# EAGLE board EasyBMS (EAGLE 9.6.2)
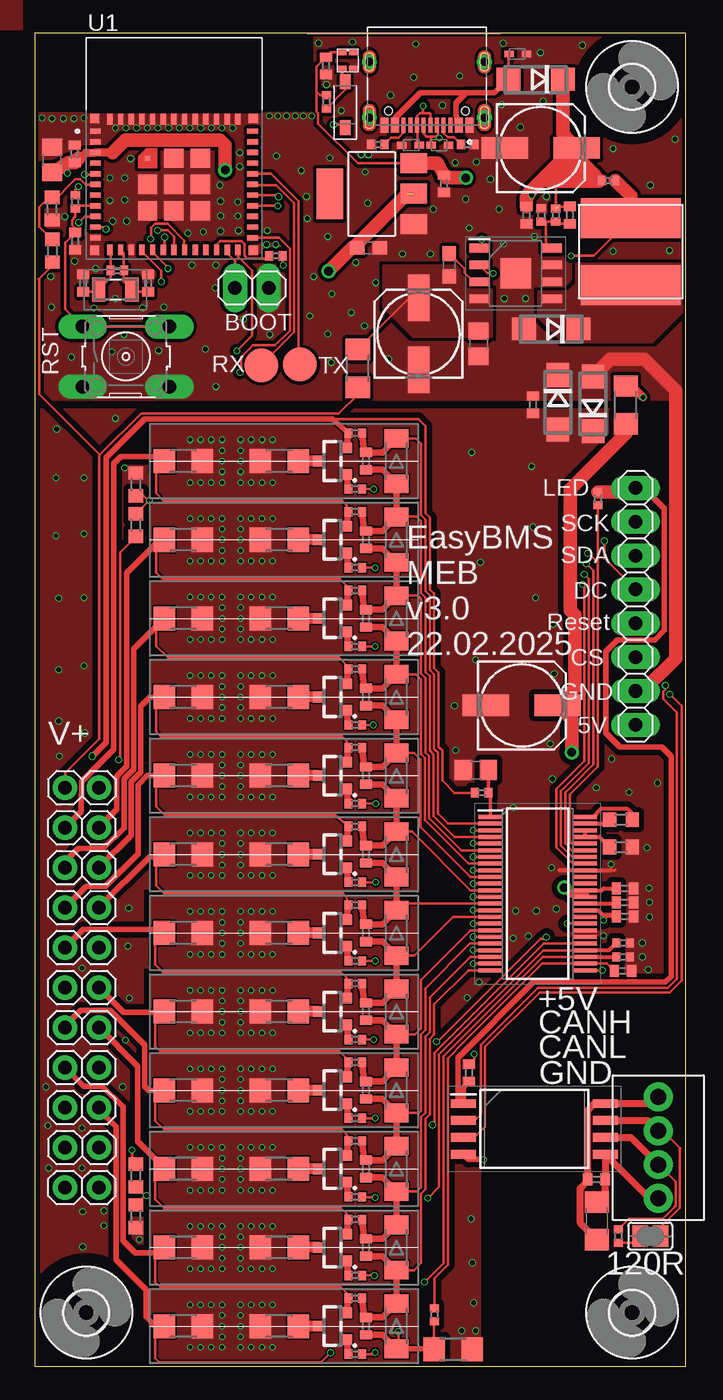
[diagram p3: board, top side]
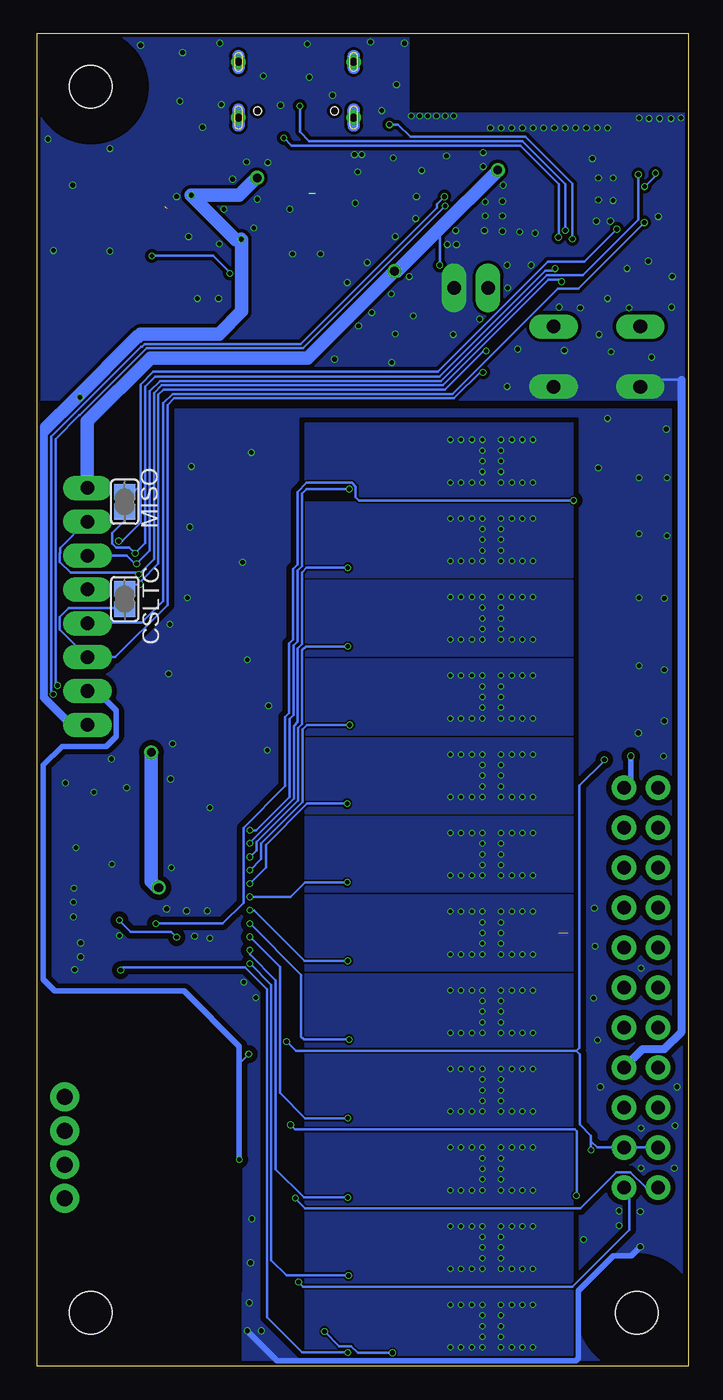
[diagram p4: board, bottom side, seen from below]

Size 48.85 x 100 mm. Coordinates in mm from the lower left corner, seen from the top.
Outline: 0,100 0,0 48.85,0 48.85,100 0,100
Copper layers (1*16): Top 0.035mm / dielectric 1.6mm / Bottom 0.035mm
Design rules "jlcpcb-2layers *": minimum track width 5mil, minimum drill 0.3mm, track to track 5mil, track to pad 5mil, pad to pad 5mil, via to via 5mil, smd to smd 5mil, copper to edge 0.2mm, drill to drill 6mil, minimum pad ring 10mil, minimum via ring 3mil, stop-mask expansion 4mil, vias tented up to drill 50mil, thermal gap 10mil

## Footprints (pad centres in the part's own frame; a part is rotated, then mirrored left to right if it is on the bottom)
1X02 = drill 1.016 long: 1 -1.27,0; 2 1.27,0
C0402 = smd 0.7 x 0.9: 1 -0.65,0; 2 0.65,0
153CLV-0605 = smd 3.5 x 1.6: + 2.7,0; - -2.7,0
C0603 = smd 1.1 x 1: 1 -0.85,0; 2 0.85,0
C1206 = smd 1.6 x 1.8: 1 -1.4,0; 2 1.4,0
C0805 = smd 1.3 x 1.5: 1 -0.95,0; 2 0.95,0
SJ = smd 1.168 x 1.6: 1 -0.762,0; 2 0.762,0
DO214AC = smd 1.8 x 1.7: A 2.05,0; C -2.05,0
MELF-MLL34 = smd 1.4 x 1.8: 1 -1.7,0; 2 1.7,0
SOD523 = smd 0.7 x 0.5: A 0.7,0; C -0.6,0
SOD3715X135 = smd 1.127 x 0.784: 1 -1.722,0; 2 1.722,0
3,2 = hole 3.2: 0,0
SOIC127P600X170-9N = smd 1.525 x 0.65: 1 -2.712,1.905; 2 -2.712,0.635; 3 -2.712,-0.635; 4 -2.712,-1.905; 5 2.712,-1.905; 6 2.712,-0.635; 7 2.712,0.635; 8 2.712,1.905 | smd 2.28 x 2.28: 9 0,0
SOP50P780X200-48N = smd 1.8 x 0.3: 1 -3.55,5.75; 2 -3.55,5.25; 3 -3.55,4.75; 4 -3.55,4.25; 5 -3.55,3.75; 6 -3.55,3.25; 7 -3.55,2.75; 8 -3.55,2.25; 9 -3.55,1.75; 10 -3.55,1.25; 11 -3.55,0.75; 12 -3.55,0.25; 13 -3.55,-0.25; 14 -3.55,-0.75; 15 -3.55,-1.25; 16 -3.55,-1.75; 17 -3.55,-2.25; 18 -3.55,-2.75; 19 -3.55,-3.25; 20 -3.55,-3.75; 21 -3.55,-4.25; 22 -3.55,-4.75; 23 -3.55,-5.25; 24 -3.55,-5.75; 25 3.55,-5.75; 26 3.55,-5.25; 27 3.55,-4.75; 28 3.55,-4.25; 29 3.55,-3.75; 30 3.55,-3.25; 31 3.55,-2.75; 32 3.55,-2.25; 33 3.55,-1.75; 34 3.55,-1.25; 35 3.55,-0.75; 36 3.55,-0.25; 37 3.55,0.25; 38 3.55,0.75; 39 3.55,1.25; 40 3.55,1.75; 41 3.55,2.25; 42 3.55,2.75; 43 3.55,3.25; 44 3.55,3.75; 45 3.55,4.25; 46 3.55,4.75; 47 3.55,5.25; 48 3.55,5.75
SOIC127P1150X280-8N = smd 1.85 x 0.65: 1 -5.325,1.905; 2 -5.325,0.635; 3 -5.325,-0.635; 4 -5.325,-1.905; 5 5.325,-1.905; 6 5.325,-0.635; 7 5.325,0.635; 8 5.325,1.905
SOT223 = smd 1.499 x 2.007: 1 -2.261,-3.15; 2 0.025,-3.15; 3 2.311,-3.15 | smd 3.81 x 2.007: 4 0,3.15
HRO_TYPE-C-31-M-12 = smd 0.6 x 1.14: A1_B12 -3.2,2.718; A4_B9 -2.4,2.718; B1_A12 3.2,2.718; B4_A9 2.4,2.718 | smd 0.3 x 1.14: A5 -1.25,2.718; A6 -0.25,2.718; A7 0.25,2.718; A8 1.25,2.718; B5 1.75,2.718; B6 0.75,2.718; B7 -0.75,2.718; B8 -1.75,2.718 | drill 0.6 pad 0.9: S1 -4.325,2.138; S2 4.325,2.138; S3 -4.325,-2.032; S4 4.325,-2.032 | hole 0.6: -2.89,1.648; 2.89,1.648
1X08 = drill 1.016 long: 1 -8.89,0; 2 -6.35,0; 3 -3.81,0; 4 -1.27,0; 5 1.27,0; 6 3.81,0; 7 6.35,0; 8 8.89,0
1X02' = drill 1.016: 1 -1.27,0; 2 1.27,0
TERMBLK_254-4N = drill 1.2: 1 0,0; 2 2.54,0; 3 5.08,0; 4 7.62,0
CY75-100UH = smd 3 x 7.5: P$1 -2.5,0; P$2 2.5,0
XL-1615RGBC-WS2812B = smd 0.45 x 0.65: DIN 0.62,-0.42; DOUT -0.62,0.42; VDD -0.62,-0.42; VSS 0.62,0.42
PG-SOT-23 = smd 0.9 x 0.8: 1 1,-1; 2 1,1; 3 -1,0
R0603 = smd 1 x 1.1: 1 -0.85,0; 2 0.85,0
R0402 = smd 0.6 x 0.7: 1 -0.5,0; 2 0.5,0
R1206 = smd 1.6 x 1.803: 1 -1.422,0; 2 1.422,0
B3F-10XX = drill 1.016 long: 1 -3.251,2.261; 2 3.251,2.261; 3 -3.251,-2.261; 4 3.251,-2.261
B2,54 = smd 2.54 x 2.54: TP 0,0
XCVR_ESP32-C6-MINI-1-N4 = smd 0.8 x 0.4: 1 -5.9,4; 2 -5.9,3.2; 3 -5.9,2.4; 4 -5.9,1.6; 5 -5.9,0.8; 6 -5.9,0; 7 -5.9,-0.8; 8 -5.9,-1.6; 9 -5.9,-2.4; 10 -5.9,-3.2; 11 -5.9,-4; 25 5.9,-4; 26 5.9,-3.2; 27 5.9,-2.4; 28 5.9,-1.6; 29 5.9,-0.8; 30 5.9,0; 31 5.9,0.8; 32 5.9,1.6; 33 5.9,2.4; 34 5.9,3.2; 35 5.9,4 | smd 0.4 x 0.8: 12 -4.8,-4.9; 13 -4,-4.9; 14 -3.2,-4.9; 15 -2.4,-4.9; 16 -1.6,-4.9; 17 -0.8,-4.9; 18 0,-4.9; 19 0.8,-4.9; 20 1.6,-4.9; 21 2.4,-4.9; 22 3.2,-4.9; 23 4,-4.9; 24 4.8,-4.9; 36 4.8,4.9; 37 4,4.9; 38 3.2,4.9; 39 2.4,4.9; 40 1.6,4.9; 41 0.8,4.9; 42 0,4.9; 43 -0.8,4.9; 44 -1.6,4.9; 45 -2.4,4.9; 46 -3.2,4.9; 47 -4,4.9; 48 -4.8,4.9 | smd 0.4 x 0.4: 49_1 -1.975,1.975 | smd 1.45 x 1.45: 49_2 0,1.975; 49_3 1.975,1.975; 49_4 -1.975,0; 49_5 0,0; 49_6 1.975,0; 49_7 -1.975,-1.975; 49_8 0,-1.975; 49_9 1.975,-1.975 | smd 0.7 x 0.7: 50 5.95,4.95; 51 5.95,-4.95; 52 -5.95,-4.95; 53 -5.95,4.95
FC135327680KAA5 = smd 1 x 1.8: 1 -1.25,0; 2 1.25,0

## Placement (x,y rotation side)
BOOT  PINHD-1X2  [1X02]  16.3,80.9 0 top
C1  1uF  [C0402]  44.3,34.8 0 top
C2  [153CLV-0605]  36.55,49.58 0 top
C3  100nF  [C0402]  37.39,72.13 90 top
C4  1uF  [C0402]  44.3,33.75 0 top
C5  1uF  [C0402]  36.9,86.35 270 top
C6  10nF  [C0402]  40.15,86.35 270 top
C7  1uF  [C0402]  30.7,88.7 270 top
C8  22uF  [C0603]  25.05,83.9 0 top
C9  15pF  [C0402]  3.65,81.25 270 top
C10  100nF  [C0402]  32.6,22 90 top
C11  100nF  [C0402]  42.15,14 0 top
C12  47uF  [C1206]  42.2,10.9 90 top
C13  1uF  [C0402]  3.05,84.4 270 top
C14  47uF  [C0805]  1.3,90.5 90 top
C15  100nF  [C0402]  3,90.95 90 top
C16  15pF  [C0402]  8.5,81.25 270 top
C17  100nF  [C0402]  21.85,97.55 270 top
C19  1uF  [C0402]  44.3,35.85 0 top
C20  100nF  [C0805]  33.1,44.72 0 top
C21  100nF  [C0805]  33.32,76.71 270 top
C23  10nF  [C0402]  44.15,29.65 0 top
C24  [153CLV-0605]  37.97,91.39 0 top
C25  10nF  [C0402]  24.85,3 270 top
C26  [153CLV-0605]  28.81,77.45 90 top
C27  1uF  [C0603]  31.12,82.61 90 top
C28  10nF  [C0402]  24.85,8.9 270 top
C29  10nF  [C0402]  24.85,14.8 270 top
C31  10nF  [C0402]  24.85,20.7 270 top
C33  10nF  [C0402]  24.85,26.6 270 top
C35  10nF  [C0402]  24.85,32.5 270 top
C37  10nF  [C0402]  24.85,38.4 270 top
C39  10nF  [C0402]  24.85,44.3 270 top
C41  10nF  [C0402]  24.85,50.2 270 top
C43  10nF  [C0402]  24.85,56.1 270 top
C45  10nF  [C0402]  24.85,62 270 top
C47  10nF  [C0402]  24.85,67.9 270 top
CSLTC  [SJ]  42.3,57.55 270 bottom
D1  SS210  [DO214AC]  39.25,72.3 270 top
D2  SS210  [DO214AC]  37.59,96.55 180 top
D3  SS210  [DO214AC]  38.75,77.82 180 top
D4  [MELF-MLL34]  27.15,3 270 top
D5  [MELF-MLL34]  27.15,8.9 270 top
D6  [MELF-MLL34]  27.15,14.8 270 top
D7  SS210  [DO214AC]  41.9,72.2 90 top
D8  [MELF-MLL34]  27.15,20.7 270 top
D9  LESD5D5.0CT1G  [SOD523]  36.2,98.45 0 top
D10  [MELF-MLL34]  27.15,26.6 270 top
D11  LESD5D5.0CT1G  [SOD523]  30.35,91.6 0 top
D12  [MELF-MLL34]  27.15,32.5 270 top
D13  LESD5D5.0CT1G  [SOD523]  28.25,91.6 180 top
D14  [MELF-MLL34]  27.15,38.4 270 top
D15  DIODE_1N4448W-TP_SOD123G  [SOD3715X135]  23.3,94.65 90 top
D16  [MELF-MLL34]  27.15,44.3 270 top
D18  [MELF-MLL34]  27.15,50.2 270 top
D20  [MELF-MLL34]  27.15,56.1 270 top
D22  [MELF-MLL34]  27.15,62 270 top
D24  [MELF-MLL34]  27.15,67.9 270 top
H1  MOUNT-HOLE3.2  [3,2]  3.87,4.02 0 top
H2  MOUNT-HOLE3.2  [3,2]  44.83,4.02 0 top
H3  MOUNT-HOLE3.2  [3,2]  44.83,95.98 0 top
IC1  XL7046  [SOIC127P600X170-9N]  36.09,81.98 0 top
IC2  LTC6811IG-1#PBF  [SOP50P780X200-48N]  37.75,35.46 0 top
IC3  ISO1042DWV  [SOIC127P1150X280-8N]  37.5,17.8 0 top
IC4  AMS1117-3.3  [SOT223]  25.3,87.95 90 top
J1  TYPE-C-31-M-12  [HRO_TYPE-C-31-M-12]  29.44,95.82 180 top
JP1  PINHD-1X8  [1X08]  45.1,57 270 top
JP2  [1X02']  3.55,43.4 0 top
JP3  [1X02']  3.55,40.4 180 top
JP4  [1X02']  3.55,37.4 180 top
JP5  [1X02']  3.55,34.4 180 top
JP6  [1X02']  3.55,31.4 180 top
JP7  2828XX-4282834-4  [TERMBLK_254-4N]  46.8,20.2 270 top
JP8  [1X02']  3.55,28.4 180 top
JP9  [1X02']  3.55,25.4 180 top
JP10  [1X02']  3.55,22.4 180 top
JP11  [1X02']  3.55,19.4 180 top
JP12  [1X02']  3.55,16.4 0 top
JP13  [1X02']  3.55,13.4 180 top
L1  C2929443  [CY75-100UH]  44.73,83.61 90 top
LED2  XL-1615RGBC-WS2812B  [XL-1615RGBC-WS2812B]  23.5,97.95 270 top
MISO  [SJ]  42.3,64.85 90 bottom
Q14  C8547  [PG-SOT-23]  22.35,3 0 top
Q15  C8547  [PG-SOT-23]  22.35,8.9 0 top
Q16  C8547  [PG-SOT-23]  22.35,14.8 0 top
Q18  C8547  [PG-SOT-23]  22.35,20.7 0 top
Q20  C8547  [PG-SOT-23]  22.35,26.6 0 top
Q22  C8547  [PG-SOT-23]  22.35,32.5 0 top
Q24  C8547  [PG-SOT-23]  22.35,38.4 0 top
Q26  C8547  [PG-SOT-23]  22.35,44.3 0 top
Q28  C8547  [PG-SOT-23]  22.35,50.2 0 top
Q30  C8547  [PG-SOT-23]  22.35,56.1 0 top
Q32  C8547  [PG-SOT-23]  22.35,62 0 top
Q34  C8547  [PG-SOT-23]  22.35,67.9 0 top
R1  100R  [R0603]  44,41 0 top
R2  10k  [R0402]  42.27,65.09 90 top
R3  10k  [R0603]  7.6,63.1 270 top
R4  C13564  [R0603]  7.6,66.15 270 top
R5  [R0402]  43.08,88.96 180 top
R6  10k  [R0402]  39.1,86.35 90 top
R7  10k  [R0603]  7.6,14.3 90 top
R8  C13564  [R0603]  7.6,11.25 90 top
R9  100R  [R0402]  33.55,43.02 180 top
R10  5K1  [R0402]  32.5,91.65 180 top
R11  5K1  [R0402]  25.75,91.65 0 top
R12  120R  [R0402]  43.8,9.75 270 top
R13  10k  [R0402]  3.05,87.35 90 top
R14  10k  [R0402]  18.1,83.3 0 top
R15  470k  [R0603]  1.33,83.68 270 top
R16  27K  [R0603]  1.31,86.83 90 top
R17  20k  [R0603]  44,38.95 180 top
R18  C370100  [R1206]  44.36,72.11 270 top
R19  100R  [R1206]  24.25,74.87 270 top
R20  10M  [R0402]  6.2,82.2 0 top
R21  10k  [R0402]  21.9,94.85 270 top
R55  3k3  [R0402]  38.02,86.37 270 top
R57  12k  [R0402]  44.15,30.7 180 top
R58  12k  [R0402]  44.15,31.75 180 top
R59  C370100  [R1206]  31.4,1.25 0 top
R60  100R  [R0402]  30,3.85 270 top
R82  10R0  [R1206]  11.15,3 0 top
R96  10R0  [R1206]  18.35,3 0 top
R97  3.3k  [R0402]  24.05,0.9 180 top
R98  100R  [R0402]  24.05,5.1 180 top
R100  10R0  [R1206]  11.15,8.9 0 top
R101  10R0  [R1206]  18.35,8.9 0 top
R102  3.3k  [R0402]  24.05,6.8 180 top
R103  100R  [R0402]  24.05,11 180 top
R104  10R0  [R1206]  11.15,14.8 0 top
R105  10R0  [R1206]  18.35,14.8 0 top
R106  3.3k  [R0402]  24.05,12.7 180 top
R107  100R  [R0402]  24.05,16.9 180 top
R112  10R0  [R1206]  11.15,20.7 0 top
R113  10R0  [R1206]  18.35,20.7 0 top
R114  3.3k  [R0402]  24.05,18.6 180 top
R115  100R  [R0402]  24.05,22.8 180 top
R120  10R0  [R1206]  11.15,26.6 0 top
R121  10R0  [R1206]  18.35,26.6 0 top
R122  3.3k  [R0402]  24.05,24.5 180 top
R123  100R  [R0402]  24.05,28.7 180 top
R128  10R0  [R1206]  11.15,32.5 0 top
R129  10R0  [R1206]  18.35,32.5 0 top
R130  3.3k  [R0402]  24.05,30.4 180 top
R131  100R  [R0402]  24.05,34.6 180 top
R136  10R0  [R1206]  11.15,38.4 0 top
R137  10R0  [R1206]  18.35,38.4 0 top
R138  3.3k  [R0402]  24.05,36.3 180 top
R139  100R  [R0402]  24.05,40.5 180 top
R144  10R0  [R1206]  11.15,44.3 0 top
R145  10R0  [R1206]  18.35,44.3 0 top
R146  3.3k  [R0402]  24.05,42.2 180 top
R147  100R  [R0402]  24.05,46.4 180 top
R152  10R0  [R1206]  11.15,50.2 0 top
R153  10R0  [R1206]  18.35,50.2 0 top
R154  3.3k  [R0402]  24.05,48.1 180 top
R155  100R  [R0402]  24.05,52.3 180 top
R160  10R0  [R1206]  11.15,56.1 0 top
R161  10R0  [R1206]  18.35,56.1 0 top
R162  3.3k  [R0402]  24.05,54 180 top
R163  100R  [R0402]  24.05,58.2 180 top
R168  10R0  [R1206]  11.15,62 0 top
R169  10R0  [R1206]  18.35,62 0 top
R170  3.3k  [R0402]  24.05,59.9 180 top
R171  100R  [R0402]  24.05,64.1 180 top
R176  10R0  [R1206]  11.15,67.9 0 top
R177  10R0  [R1206]  18.35,67.9 0 top
R178  3.3k  [R0402]  24.05,65.8 180 top
R179  100R  [R0402]  24.05,70 180 top
RST  [B3F-10XX]  6.85,75.75 0 top
RX  TPB2,54  [B2,54]  17,75.1 0 top
TERM  [SJ]  46.2,9.75 180 top
TX  TPB2,54  [B2,54]  19.9,75.15 0 top
U1  ESP32-C6-MINI-1-N4  [XCVR_ESP32-C6-MINI-1-N4]  10.45,88.65 0 top
Y1  FC-135_32.7680KA-A5  [FC135327680KAA5]  6.05,80.75 180 top

## Tracks (layer width: path | path; a pad name or v marks a point on that pad's centre or on a via)
+3V3  (via drill 0.35, 0.65 pad 1.05)  (1 unrouted)
  Top 0.2: R13.2 3.05,88.28 v3.27,88.5 | C14.1 2.4,89.55 v2.45,89.5 | R14.2 18.6,82.65 v18.65,82.6
  Top 0.406: JP1.1 45.71,65.89 47.26,64.34 47.26,55.22 46.53,54.49 43.72,54.49 42.85,53.62 42.85,47.5 43.9,46.45 47.05,46.45 47.77,45.73 47.77,29.24 47.34,28.81 37.44,28.81 31.78,23.15 31.78,20.11 IC3.1 32.18,20.93 C10.1
  Top 0.61: 5.85,91.05 U1.3 3.86,91.05 3.63,90.82 3.52,90.82 3.31,90.61
  Top 1: 7.55,91.98 13.91,91.98
  Top 1.016: 27.98,87.97 24.14,84.14 24.2,84.12 C8.1 23.8,83.9 v22.05,82.15 | R2.2 44.8,65.59 JP1.1 | v14.3,89.74 14.3,91.6 13.91,91.98 | 5.85,91.05 6.78,91.98 7.55,91.98 | C14.1 2.53,90.3 C15.1 3.31,90.61
  Bottom 0.2: v3.27,88.5 2.45,89.32 v2.45,89.5 | v18.65,82.6 18.65,85.1 18.78,85.22
  Bottom 1.016: v14.3,89.74 14.3,89.7 18.78,85.22 21.85,82.15 v22.05,82.15 28.57,75.64 40.37,75.64 45.1,70.9 JP1.1
+5V  (via drill 0.65 pad 1.05)
  Top 0.3: C19.1 42.7,35.85 42.56,35.71 IC2.37 41.3,35.45 IC2.36
  Top 0.61: v39.75,35.9 40.2,35.45 41.3,35.45
  Top 1.016: v40.3,46.05 40.3,48.53 C2.+ 40.53,50.86 40.53,56.37 40.2,56.7 40.2,65.8 44.36,69.96 R18.2
  Bottom 1.016: v40.3,46.05 40.3,36.35 39.85,35.9 v39.75,35.9
+5V/1  (via drill 0.35, 0.65 pad 1.05)  (1 unrouted)
  Top 0.2: R6.2 39.1,88.9 | 39.35,88.95 39.4,88.9 | IC1.1 33.55,84.06 v33.55,84.55 | v37.3,87.85 37.12,88.03 37.12,88.08 | 39.25,87 C6.1 | R5.2 42.52,88.9 41.75,88.9 | 21.15,95.6 21.15,97.5 C17.1 22.22,98.57 LED2.VDD | 21.15,95.6 21.4,95.35 R21.1 | IC4.3 28.44,90.25 24.25,90.25 21.28,93.22 21.28,94 21.15,94.13 21.15,95.6
  Top 0.61: 30.88,89.15 C7.1 | v45.65,72.69 44.8,73.53 R18.1
  Top 1.016: C24.+ 40.67,90.29 | D2.C 39.64,92.5 39.81,92.25 C24.+ | IC4.3 30.24,90.26 C7.1 | C5.1 36.9,87.67 37.2,88.1 37.12,88.03 | 37.12,88.08 38,88.95 | 38,88.95 39.35,88.95 40.35,89.95 | 38,88.95 40.44,91.39 C24.+ | 39.1,88.9 39.4,88.9 41.75,88.9 42.38,88.9 42.43,88.95 41.84,89.54 | 41.84,89.54 41.09,90.29 40.67,90.29 | 40.67,90.29 40.67,90.27 40.35,89.95 | 41.84,89.54 40.76,89.54 40.35,89.95 | v32.35,89.15 30.88,89.15
  Bottom 0.61: JP1.8 46.33,48.11 48.34,50.13 48.34,70.01 | v45.65,72.69 45.66,72.69 | v45.65,72.69 45.62,72.69 | 33.52,84.52 v33.55,84.55 34,84.55 | 48.03,70.33 48.34,70.01 | 48.34,70.01 48.34,70.24 48.14,70.45 | v45.65,72.69 45.9,72.69 46.07,72.52
  Bottom 1.016: v32.35,89.15 32.4,89.15 33.7,87.85 v37.3,87.85 34,84.55 33.97,84.52 33.52,84.52 | v33.55,84.55 33.51,84.51 33.51,79.14 35.23,77.43 41.11,77.43 41.31,77.23 41.35,77.23 46.07,72.52 48.14,70.45
A0DSPL  (via drill 0.35)
  Top 0.2: JP1.4 42.75,60.62 v42.75,61.9 | U1.10 5.21,85.45 v5.36,85.31
  Bottom 0.2: 41.1,66.1 41.1,73.65 40.15,74.6 18.8,74.6 10.54,82.86 7.81,82.86 v5.36,85.31 | 41.1,66.1 41.1,63.3 42.5,61.9 v42.75,61.9 | MISO.2 41.59,65.61 41.1,66.1
C0
  Top 0.2: R60.1 30,6.59 31,7.59 31,23.1 32.18,24.27 38.11,30.21 IC2.26 42.94,30.21 C23.1
C1
  Top 0.2: IC2.24 32.54,29.71 29.98,27.15 29.98,24.88 29.65,24.55 29.65,18.88 29.33,18.55 29.33,13.27 29,12.94 29,7.75 28.45,7.2 D5.2
  Top 0.5: R98.1 24.7,3.8 C25.1 26.1,3.65 D4.1 D5.2 26.1,8.25 C28.2
C1+
  Top 0.2: R98.2 23.4,5.5 22.95,5.95 9.4,5.95 9.05,6.3 9.05,8.45 9.5,8.9 R100.1
  Top 0.4: R100.1 9.33,8.5 7.53,8.5 6.62,9.4 6.62,19.45 5.07,21 3.68,21 JP10.2
  Top 0.5: Q14.2 23.4,4.05 R98.2
C1-  (via drill 0.35)
  Top 0.2: R82.1 9.05,2.32 9.05,0.6 9.35,0.3 21.5,0.3 v22.2,1 | R59.1 29.98,3.18 R60.2 | v27.3,2.6 27.3,1.35 27.35,1.3
  Top 0.4: R82.1 9.05,3 8.35,3.7 8.35,5.73 6.1,7.99 6.1,17.95 4.82,19.23 JP11.1 | D4.2 27.35,1.3 29.93,1.3 R59.1
  Top 0.5: C25.2 26.1,2.35 D4.2
  Bottom 0.2: v22.2,1 24.8,1 25.3,1.51 26.21,1.51 v27.3,2.6
C2
  Top 0.2: IC2.22 32.71,30.71 29.65,27.65 29.65,25.08 29.33,24.75 29.33,19.02 29,18.69 29,13.4 28.7,13.1 D6.2
  Top 0.5: R103.1 24.7,9.7 C28.1 26.1,9.55 D5.1 D6.2 26.1,14.15 C29.2
C2+
  Top 0.2: R103.2 23.4,11.45 23,11.85 9.7,11.85 9.05,12.5 9.05,14.3 9.55,14.8 9.67,14.93
  Top 0.4: 9.67,14.93 7.72,16.88 7.72,22.5 JP9.1 | 9.55,14.8 R104.1
  Top 0.5: Q15.2 23.4,9.95 R103.2
C3
  Top 0.2: IC2.20 32.68,31.71 29.33,28.35 29.33,25.21 29,24.89 29,19.15 28.85,19 D8.2
  Top 0.5: R107.1 24.7,15.6 C29.1 26.1,15.45 D6.1 D8.2 26.1,20.05 C31.2
C3+
  Top 0.2: R107.2 23.4,17.4 23.05,17.75 9.7,17.75 9.05,18.4 9.05,20.65 9.1,20.7
  Top 0.4: R112.1 9.1,20.7 8.55,20.7 8.25,21 8.25,24.1 5.65,26.7 3.45,26.7 2.28,25.53 JP9.2
  Top 0.5: Q16.2 23.4,15.85 R107.2
C4
  Top 0.2: IC2.18 32.72,32.71 29,28.99 29,25.35 28.55,24.9 D10.2
  Top 0.5: R115.1 24.7,21.5 C31.1 26.1,21.35 D8.1 D10.2 26.1,25.95 C33.2
C4+
  Top 0.2: R115.2 23.4,23.1 22.85,23.65 9.4,23.65 9.05,24 9.05,25.95 9.7,26.6 R120.1
  Top 0.4: JP8.1 6.67,26.55 9.68,26.55 R120.1
  Top 0.5: Q18.2 23.4,21.75 R115.2
C5
  Top 0.2: IC2.16 31.41,33.71 28.5,30.8 D12.2
  Top 0.5: R123.1 24.7,27.4 C33.1 26.1,27.25 D10.1 D12.2 26.1,31.85 C35.2
C5+  (1 unrouted)
  Top 0.2: R123.2 23.4,29.15 23,29.55 9.65,29.55 9.05,30.15 9.05,32.5
  Top 0.4: JP6.2 3.63,32.75 9.48,32.75 R128.1
  Top 0.5: Q20.2 23.4,27.65 R123.2
C6
  Top 0.2: IC2.14 27.26,34.71 27.15,34.6
  Top 0.5: R131.1 24.7,33.3 C35.1 26.1,33.15 D12.1 27.15,34.6 D14.2 26.1,37.75 C37.2
C6+
  Top 0.2: R131.2 23.4,35.2 23.15,35.45 9.7,35.45 9.1,36.05 9.1,38.2
  Top 0.4: R136.1 9.53,38.2 9.1,38.2 8.62,38.2 JP5.1
  Top 0.5: Q22.2 23.4,33.55 R131.2
C7
  Top 0.2: IC2.12 32.69,35.71 28.3,40.1 D14.1
  Top 0.5: R139.1 24.7,39.2 C37.1 26.1,39.05 D14.1 D16.2 26.1,43.65 C39.2
C7+
  Top 0.2: R139.2 22.55,41.35 9.75,41.35 9.1,42 9.1,44.3
  Top 0.4: R144.1 9.1,44.3 8.45,44.3 7.75,43.6 7.75,38.45 5.3,36 3.88,36 JP5.2
  Top 0.5: Q24.2 23.4,39.45 R139.2
C8
  Top 0.2: IC2.10 32.7,36.71 28.95,40.46 28.95,45.5 28.45,46 D16.1
  Top 0.5: R147.1 24.7,45.1 C39.1 26.1,44.95 D16.1 D18.2 26.1,49.55 C41.2
C8+
  Top 0.2: R147.2 23.4,46.9 23.05,47.25 9.45,47.25 9.1,47.6 9.1,50.2
  Top 0.4: R152.1 9.1,50.2 8.65,50.2 7.95,49.5 7.95,44.55 7.22,43.82 7.22,40.6 7.22,39.8 JP4.1
  Top 0.5: Q26.2 23.4,45.35 R147.2
C9
  Top 0.2: IC2.8 32.57,37.71 29.28,41 29.28,45.63 29,45.91 29,51.5 28.6,51.9 D18.1
  Top 0.5: R155.1 24.7,51 C41.1 26.1,50.85 D18.1 D20.2 26.1,55.45 C43.2
C9+
  Top 0.2: R155.2 23.4,52.6 22.85,53.15 10,53.15 9.11,54.04 9.11,55.49
  Top 0.4: R160.1 9.11,55.49 7.42,53.8 7.42,44.76 6.7,44.04 6.7,40.7 6.7,40.4 5.15,38.85 3.25,38.85 2.28,37.88 JP4.2
  Top 0.5: Q28.2 23.4,51.25 R155.2
C10
  Top 0.2: IC2.6 32.03,38.71 29.6,41.13 29.6,45.77 29.33,46.05 29.33,51.63 29,51.96 29,57.55 28.75,57.8 D20.1
  Top 0.5: R163.1 24.7,56.9 C43.1 26.1,56.75 D20.1 D22.2 26.1,61.35 C45.2
C10+
  Top 0.2: R163.2 23.4,58.55 22.9,59.05 9.6,59.05 9.1,59.55 9.1,61.95 9.15,62
  Top 0.4: R168.1 9.4,62 | 9.4,62 9.15,62 | 9.4,62 6.9,59.5 6.9,44.98 6.17,44.26 6.17,41.75 JP3.1
  Top 0.5: Q30.2 23.4,57.15 R163.2
C11
  Top 0.2: IC2.4 31.49,39.71 29.93,41.27 29.93,45.91 29.65,46.18 29.65,51.77 29.33,52.1 29.33,57.69 29,58.01 29,63.4 28.65,63.75 27.15,63.75
  Top 0.5: R171.1 24.7,62.8 C45.1 26.1,62.65 D22.1 27.15,63.75 D24.2 26.1,67.25 C47.2
C11+
  Top 0.2: R171.2 23.4,64.6 23.05,64.95 9.65,64.95 9.1,65.5 9.1,68.2 9.1,68.25
  Top 0.4: 9.1,68.25 6.45,68.25 5.92,67.72 5.92,46.27 3.52,43.87 3.52,42.89 3.5,42.86 3.5,41.62 JP3.2 | R176.1 9.43,68.2 9.1,68.2
  Top 0.5: Q32.2 23.4,63.05 R171.2
C12
  Top 0.2: IC2.2 31,40.71 30.26,41.45 30.26,46.04 29.98,46.32 29.98,51.91 29.65,52.23 29.65,57.82 29.33,58.15 29.33,63.53 29,63.86 29,69.2 28.6,69.6 D24.1
  Top 0.5: R179.1 24.7,68.7 C47.1 26.1,68.55 D24.1
C12+  (via drill 0.4)
  Top 0.2: 22.35,71.05 28.8,71.05 29.33,70.52 29.33,64 29.65,63.67 29.65,58.28 29.98,57.96 29.98,52.37 30.31,52.04 30.31,46.45 30.59,46.18 30.59,43.95 31.51,43.02 R9.2
  Top 0.4: R179.2 22.35,71.05 8.25,71.05 5.35,68.15 5.35,46.78 v4.32,45.75
  Top 0.5: Q34.2 23.4,68.95 R179.2
  Bottom 0.4: JP2.2 4.32,43.9 v4.32,45.74 v4.32,45.75
C12+POWER
  Top 0.2: 4.88,68.38 7.98,71.48 22.82,71.48 24.25,72.91 R19.2 | 4.88,68.38 4.83,68.33 4.83,47.05 2.28,44.5 JP2.1 | 4.88,68.38 0.33,72.93 0.33,81.51 0.32,81.57 1.33,82.58 R15.2
CSDSPL  (via drill 0.35)
  Top 0.2: v15.41,74.56 15.5,74.65 15.5,75.72 16.38,76.6 18.04,76.6 19.15,77.71 19.15,83.83 18.32,84.65 U1.25
  Bottom 0.2: v15.41,74.56 15.52,74.67 17.57,72.61 38.57,72.61 39.07,72.11 39.07,57.12 43,53.19 JP1.6 47.16,55.25 47.16,56.2 46.49,56.88 42.88,56.88 42.79,56.79 CSLTC.2
CSLTC  (via drill 0.35)
  Top 0.2: IC2.41 40.38,37.71 39.17,38.92 39.17,43.31 41.27,45.41 41.27,58.58 41.19,58.58 v41.12,58.65 | U1.24 15.25,83.23 16.3,82.18 16.3,77.3 v15.17,76.17
  Bottom 0.2: v15.17,76.17 15.38,76.17 18.28,73.27 39.38,73.27 39.77,72.88 39.77,60.2 41.12,58.86 v41.12,58.65 41.96,58.65 CSLTC.1
D+  (via drill 0.35)
  Top 0.2: J1.A6 29.69,93.96 29.65,94 29.15,94 | 29.15,94 28.9,94 28.69,93.79 J1.B6 28.71,93.08 28.71,91.74 D13.C | 29.15,94 v29.15,94.55 | v9.22,85.22 9.98,85.22 10.45,84.75 U1.18
  Bottom 0.2: v29.15,94.55 29.15,92.6 28.45,91.9 12.45,91.9 9.22,88.67 v9.22,85.22
D-  (via drill 0.35)
  Top 0.2: J1.A7 29.2,93.09 29.2,92.45 29.4,92.25 29.7,92.25 | 30.25,92.4 30.1,92.25 29.7,92.25 | 30.25,92.4 30.25,93.04 J1.B7 | 30.25,92.4 30.25,92.25 v30.35,92.15 | U1.17 9.75,83.85 v9.75,84.7 | 29.7,92.25 29.75,92.2 D11.C
  Bottom 0.2: v30.35,92.15 29.77,91.57 12.58,91.57 9.7,88.69 9.7,84.75 v9.75,84.7
GND  (via drill 0.35)
  Top 0.2: C10.2 33,23.05 v33,23.4
  Top 0.406: v33.7,15.5 32.57,15.5 IC3.4
  Top 1.016: JP1.7 45.85,50.65 46.14,50.95 45.96,50.95 48.11,53.1 48.11,73.19 45.75,75.55 43.2,75.55 D7.A
  Bottom 0.2: v33,23.4 33.7,22.7 33.7,22.1 | 0.51,74 3.08,74 RST.3
  Bottom 0.406: JP1.7 44.4,50.65 42.94,49.19 42.94,47.26 43.7,46.5 47,46.5 48.4,45.1 48.4,29 47.55,28.15 37.85,28.15 33.7,24 33.7,22.1 v33.7,15.5
  Bottom 0.61: JP10.1 3.42,23.8 1.8,23.8 0.51,25.09 0.51,74
  other vias: 38.4,87.75 37.5,84.75 35.2,84.2 32.6,85.4 36.85,80.1 35.25,80.1 3,82.9 8.1,79.4 9.7,79.45 6.05,80.1 7.2,90.6 5.65,87.45 6.75,89.15 15.25,87.35 15.25,86.3 13.55,80.9 20,89.7 12.45,92.9 14.85,92.9 25.6,81.3 23.75,79.05 24.75,78.05 22,84.75 25,87.25 24.8,89.6 26.55,75.55 34.2,89.05 32.35,87.55 33.15,90.35 26.7,95.35 28.45,96.7 31.9,96.8 30.6,94.6 35.05,94.65 23.85,99.35 28.6,99.2 35.15,99.25 41.1,99.1 21.3,99.25 38.15,94.9 36.45,92.95 15.3,85.2 13.95,86.3 11.5,85 11.8,82.6 20.4,87.75 0.55,93.65 11.65,92.9 2.95,93.6 3.7,93.65 17.6,93.8 18.25,93.8 18.9,93.8 19.55,93.8 20.15,93.8 20.8,93.8 1.3,93.6 2.15,93.6 10.85,92.9 13.95,85.15 6.05,92.9 4.6,82.35 6.7,77.4 12.8,76.3 13.6,73.5 5.8,76.1 22,77.45 20.95,81.75 22.3,80.45 22.25,75.3 29.7,83.45 27.6,83.45 29.9,86.8 34.85,86.8 20.65,78.8 43.4,91.35 46.2,88.6 48.05,92.05 43.4,83.65 47.65,83.7 22.15,90.65 18.15,90.8 1.2,81.75 5.85,85.9 6.75,87.5 6.9,85.9 2.75,75.7 1.25,79.45 4.45,79.4 9.3,76.2 24.1,82.8 20.45,86.1 13.25,92.9 14.05,92.9 10.05,92.9 9.25,92.9 8.45,92.9 7.65,92.9 6.85,92.9 5.65,89.15 13.95,87.4 13.9,88.6 12.65,85.1 15.4,90 15.4,91.05 17.45,85.2 15.65,78.55 17.65,77.4 17.4,84.15 18.1,84.15 13.6,82.6 23,94.2 37.95,98.55 31.55,90.3 24.5,90.9 21.9,96.15 25.05,90.9 2.25,86.25
  pour Bottom (isolate 0.254, no thermals): -0.1,72.47 49.1,72.47 49.1,100.25 27.8,100.25 20.95,100.34 20.95,94 -0.1,94
  pour Top (isolate 0.4, rank 3, no thermals): -4.5,105.43 -0.95,105.43 -0.95,100.27 -4.5,100.27
  pour Top (isolate 0.254, rank 3, no thermals): -0.5,72.47 -0.5,94.05 20.95,94.05 20.95,100.26 27.89,100.29 49.08,100.28 49.08,72.47
GND2  (via drill 0.35)
  Top 0.2: 43.25,37.21 43.54,37.21 43.55,37.2 43.58,37.23
  Top 0.305: 43.25,37.21 IC2.40 39.39,37.21
  Bottom 0.406: v3.6,8.95 4.27,8.28 5.63,8.28 8.25,5.67 8.25,0.6 8.45,0.4 30.85,0.4 v33.1,2.65
  other vias: 32.8,68.55 33.45,60.3 33.1,53 6.75,67.4 7.85,9.5 3.6,11.6 5.2,11.65 5.2,10.55 1.05,14.85 1,18.05 0.85,20.95 3.55,17.85 3.55,14.85 6.6,20.95 6.8,24.45 7.1,27.6 3.55,29.85 7.05,34.35 7,31.5 1.85,45.75 3.75,47.5 3.7,52.55 3.7,57.65 3.7,62.45 3.7,66.65 6.05,71.1 1.65,70.3 1.6,66.65 1.6,62.3 1.8,57.6 1.8,52.25 1.8,48.4 38.9,55.65 39,51.95 38.7,46.7 38.85,44.05 43.3,45.55 42.15,43.4 46.75,43.75 45.95,38.9 46.1,35.85 46.15,34.8 46.15,33.7 39.15,34.3 38.8,37.4 36.1,34.15 35.9,32.1 37.05,32.25 45.6,30.7 37.3,67.5 37.4,62.95 37.6,57.65 44.6,43.05 31.6,46.2 31.5,49.55 32.75,11.05 32.95,4.75 32.05,2.65 32.85,7.75 45.6,31.75 43.25,37.65 42.7,32.3 46.05,29.75 35.9,41.9 37.65,34.15 33.35,28.8 32.45,27.65
  pour Top (isolate 0.4, rank 4, no thermals): -0.81,71.82 49.05,71.82 49.05,50.32 49.13,50.24 49.13,27.94 37.84,27.94 33.45,23.55 33.45,-0.29 -0.81,-0.25
  pour Bottom (isolate 0.4, rank 4, no thermals): -0.43,71.82 49.15,71.82 49.15,27.89 37.92,28.06 33.39,23.53 33.47,-0.43 -0.43,-0.21
IBIAS
  Top 0.3: R17.2 42.39,39.71 IC2.45 IC2.46
IMB
  Top 0.3: IC2.47 42.86,40.71 R1.1
IPB
  Top 0.3: IC2.48 41.92,41.21 42.54,41.83 44.47,41.83 44.85,41.45 R1.2
LEDDATA  (via drill 0.35)
  Top 0.2: U1.19 11.23,83.77 11.23,84.44 9.96,85.7 9.02,85.7 8.74,85.42 8.74,84.61 v8.7,84.57 | v22.43,93.15 23.08,93.15 D15.1
  Bottom 0.2: v22.43,93.15 21.77,93.15 20.85,92.23 12.21,92.23 8.7,88.71 v8.7,84.57
MISO  (via drill 0.35)
  Top 0.2: IC2.44 40.29,39.21 40.15,39.35 40.15,42.9 42.25,45 42.25,60.3 | 42.25,60.3 42.25,64.57 R2.1 | 42.25,60.3 41.6,60.95 41.55,60.95 v41.51,60.99 | v10,82.35 10,82.42 8.85,83.57 U1.16
  Bottom 0.2: v10,82.35 10.15,82.2 10.74,82.2 18.69,74.25 40,74.25 40.76,73.49 40.76,61.74 v41.51,60.99 41.95,61.42 42.95,61.42 43.23,61.7 43.23,62.52 42.3,63.45 MISO.1
MODULEVOLTAGE
  Top 0.2: U1.6 3.82,88.65 3.42,89.05 3.05,89.05 1.31,87.31 R16.2 1.08,87.68 0.35,86.95 0.35,85.51 R15.1
MOSI  (via drill 0.35)
  Top 0.2: IC2.43 40.33,38.71 39.82,39.22 39.82,43.03 41.92,45.13 41.92,59.68 v41.4,60.2 | U1.5 4.6,89.4 v3.75,89.4
  Bottom 0.2: JP1.3 42.16,60.81 41.55,60.2 v41.4,60.2 41.4,60.22 40.43,61.19 40.43,73.14 39.65,73.92 18.55,73.92 10.62,81.85 7.9,81.85 3.75,86 v3.75,89.4
N$1  (via drill 0.35)
  Top 0.2: v47.34,51.07 47.34,50.76 47.18,50.61 47.18,50.07 48.2,49.05 48.2,29.06 47.52,28.38 37.77,28.38 33.47,24.09 33.47,18.87 33.04,18.43 IC3.2 | v18.25,87.05 v18.24,87.05 U1.28
  Bottom 0.2: v47.34,51.07 47.49,51.22 47.49,69.56 45.7,71.35 45.69,71.35 40.67,76.37 28.92,76.37 v18.25,87.05
N$2
  Top 0.2: TX.TP 19.8,75.25 19.8,87.4 17.75,89.45 U1.31
N$4
  Top 0.2: D2.A 35.54,98.39 D9.C
  Top 0.406: D2.A 35.49,96.55 34.49,95.55 32.4,95.55 | J1.A4_B9 31.67,93.27 31.67,93.81 31.62,93.85 31.62,94.77 32.4,95.55 | J1.B4_A9 27.04,93.64 28.95,95.55 32.4,95.55
N$6
  Top 0.2: IC1.3 32.96,81.34 32.25,82.05 32.25,82.35 31.12,83.47 C27.2
N$7
  pour Top (no thermals): 37.8,80.65 40.05,80.65 40.65,81.25 40.65,82.75 48.55,82.75 48.7,82.6 48.7,79.15 46.35,76.8 39.65,76.8 37.8,78.65
N$8
  Top 0.2: J1.A5 30.69,92.51 31,92.2 31.45,92.2 R10.2
N$9
  Top 0.2: J1.B5 27.69,92.54 27.3,92.15 26.75,92.15 R11.2
N$10
  Top 0.2: RX.TP 19.47,77.57 19.47,87.27 18.12,88.62 16.38,88.62 U1.30
N$11  (via drill 0.35)
  Top 0.2: v47.66,50.41 48.55,49.52 48.55,28.95 47.66,28.06 37.91,28.06 33.8,23.95 33.8,17.95 33.02,17.16 IC3.3 | v18.3,87.75 18.2,87.85 U1.29
  Bottom 0.2: v47.66,50.41 47.81,50.56 47.81,69.74 41.05,76.5 41,76.5 40.8,76.7 29.11,76.7 18.88,86.93 18.88,87.17 v18.3,87.75
N$12
  Top 0.508: JP7.1 46.3,19.7 IC3.8 42.01,19.7 41.5,19.2 C11.1 41.5,13.89 40.92,13.31 40.92,10.76 C12.1
N$13
  Top 0.2: TERM.1 46.96,10.4 48.43,11.87 48.43,16.33 48.45,16.35 47.14,17.66 JP7.2
  Top 0.508: IC3.7 46.02,18.43 JP7.2
N$14
  Top 0.2: JP7.3 48.11,13.81 48.11,12.04 48.05,11.98 48.05,11.95 47.15,11.05 44.6,11.05 R12.1
  Top 0.508: IC3.6 44.76,17.16 JP7.3
N$15  (via drill 0.35)
  Top 0.2: L1.P$2 41.95,83.33 40.28,83.33 v40.26,83.31 | v34.4,82 33.99,82 IC1.2
  Top 1.016: L1.P$2 44.73,87.8 R5.1
  Bottom 0.2: v40.26,83.31 35.66,83.31 34.4,82.05 34.35,82.05 v34.4,82
N$16
  Top 0.508: JP7.4 46.14,12.58 IC3.5 42.83,14.03 C11.2 42.8,12.86 C12.2
N$17
  Top 0.2: U1.8 3.25,87.05 R13.1 3.05,86.23 2.82,86 2.82,85.6 3.05,85.37 C13.1 2.3,84.3 2.3,79.31 RST.1 RST.2
N$18  (via drill 0.3)
  other vias: 11.65,4.6 12.45,4.6 13.25,4.6 14.05,4.6 14.05,3.8 14.05,3 14.05,2.2 14.05,1.4 13.25,1.4 12.45,1.4 17.85,4.6 17.05,4.6 16.25,4.6 15.45,4.6 15.45,3.8 15.45,3 15.45,2.2 15.45,1.4 16.25,1.4 17.05,1.4 11.65,1.4 17.85,1.4
  pour Top (rank 2, no thermals): 8.65,5.8 28.75,5.8 28.75,0.2 8.65,0.2
  pour Bottom (rank 2, no thermals): 28.75,5.8 28.75,0.2 8.65,0.2 8.65,5.8
N$19
  Top 0.2: TERM.2 44.94,9.25 R12.2
N$20
  Top 0.2: U1.22 13.65,84.15 13.9,84.4 15.52,84.4 15.75,84.17 15.75,83.3 15.95,83.1 17.4,83.1 R14.1
N$21
  Top 0.2: BOOT.1 15.03,82.92 14.45,83.5 U1.23
N$22
  Top 0.2: U1.12 5.7,83.7 R20.1 5.7,81.65 Y1.2 4.65,80.6 C9.2
N$23
  Top 0.2: U1.13 6.45,83.73 6.68,83.5 6.68,82.22 | 6.68,82.22 6.68,81.37 Y1.1 7.45,80.6 C16.2 | R20.2 6.68,82.22
N$24
  Top 0.2: LED2.DIN 23.08,96.59 D15.2 23.3,95.75 R21.2
N$25
  Top 0.2: IC1.8 38.37,84.32 38.37,85.8 38.42,85.85 38.03,85.79 R55.2 38.04,85.85 R6.1 39.25,85.7 C6.2
N$73
  Top 0.2: R19.1 28.11,80.16 C26.+
  pour Top (no thermals): 32.35,82.55 26.15,82.55 26.15,79.45 28.35,77.25 34.35,77.25 34.35,80.75 32.35,80.75
N$75
  Top 0.813: Q14.3 R96.2
N$76
  Top 0.5: Q14.1 23.4,1.95 R97.2
N$77  (via drill 0.3)
  other vias: 11.65,10.5 12.45,10.5 13.25,10.5 14.05,10.5 14.05,9.7 14.05,8.9 14.05,8.1 14.05,7.3 13.25,7.3 12.45,7.3 17.85,10.5 17.05,10.5 16.25,10.5 15.45,10.5 15.45,9.7 15.45,8.9 15.45,8.1 15.45,7.3 16.25,7.3 17.05,7.3 11.65,7.3 17.85,7.3
  pour Top (rank 2, no thermals): 8.65,11.7 28.75,11.7 28.75,6.11 8.65,6.11
  pour Bottom (rank 2, no thermals): 28.75,11.7 28.75,6.11 8.65,6.11 8.65,11.7
N$78
  Top 0.813: Q15.3 R101.2
N$79
  Top 0.5: Q15.1 23.4,7.85 R102.2
N$81  (via drill 0.3)
  other vias: 11.65,16.4 12.45,16.4 13.25,16.4 14.05,16.4 14.05,15.6 14.05,14.8 14.05,14 14.05,13.2 13.25,13.2 12.45,13.2 17.85,16.4 17.05,16.4 16.25,16.4 15.45,16.4 15.45,15.6 15.45,14.8 15.45,14 15.45,13.2 16.25,13.2 17.05,13.2 11.65,13.2 17.85,13.2
  pour Top (rank 2, no thermals): 8.65,17.6 28.75,17.6 28.75,12.01 8.65,12.01
  pour Bottom (rank 2, no thermals): 28.75,17.6 28.75,12.01 8.65,12.01 8.65,17.6
N$82
  Top 0.813: Q16.3 R105.2
N$83
  Top 0.5: Q16.1 23.4,13.75 R106.2
N$87  (via drill 0.3)
  other vias: 11.65,22.3 12.45,22.3 13.25,22.3 14.05,22.3 14.05,21.5 14.05,20.7 14.05,19.9 14.05,19.1 13.25,19.1 12.45,19.1 17.85,22.3 17.05,22.3 16.25,22.3 15.45,22.3 15.45,21.5 15.45,20.7 15.45,19.9 15.45,19.1 16.25,19.1 17.05,19.1 11.65,19.1 17.85,19.1
  pour Top (rank 2, no thermals): 8.65,23.5 28.75,23.5 28.75,17.91 8.65,17.91
  pour Bottom (rank 2, no thermals): 28.75,23.5 28.75,17.91 8.65,17.91 8.65,23.5
N$88
  Top 0.813: Q18.3 R113.2
N$89
  Top 0.5: Q18.1 23.4,19.65 R114.2
N$93  (via drill 0.3)
  other vias: 11.65,28.2 12.45,28.2 13.25,28.2 14.05,28.2 14.05,27.4 14.05,26.6 14.05,25.8 14.05,25 13.25,25 12.45,25 17.85,28.2 17.05,28.2 16.25,28.2 15.45,28.2 15.45,27.4 15.45,26.6 15.45,25.8 15.45,25 16.25,25 17.05,25 11.65,25 17.85,25
  pour Top (rank 2, no thermals): 8.65,29.4 28.75,29.4 28.75,23.8 8.65,23.8
  pour Bottom (rank 2, no thermals): 28.75,29.4 28.75,23.8 8.65,23.8 8.65,29.4
N$94
  Top 0.813: Q20.3 R121.2
N$95
  Top 0.5: Q20.1 23.4,25.55 R122.2
N$99  (via drill 0.3)
  other vias: 11.65,34.1 12.45,34.1 13.25,34.1 14.05,34.1 14.05,33.3 14.05,32.5 14.05,31.7 14.05,30.9 13.25,30.9 12.45,30.9 17.85,34.1 17.05,34.1 16.25,34.1 15.45,34.1 15.45,33.3 15.45,32.5 15.45,31.7 15.45,30.9 16.25,30.9 17.05,30.9 11.65,30.9 17.85,30.9
  pour Top (rank 2, no thermals): 8.65,35.3 28.75,35.3 28.75,29.7 8.65,29.7
  pour Bottom (rank 2, no thermals): 28.75,35.3 28.75,29.7 8.65,29.7 8.65,35.3
N$100
  Top 0.813: Q22.3 R129.2
N$101
  Top 0.5: Q22.1 23.4,31.45 R130.2
N$105  (via drill 0.3)
  other vias: 11.65,40 12.45,40 13.25,40 14.05,40 14.05,39.2 14.05,38.4 14.05,37.6 14.05,36.8 13.25,36.8 12.45,36.8 17.85,40 17.05,40 16.25,40 15.45,40 15.45,39.2 15.45,38.4 15.45,37.6 15.45,36.8 16.25,36.8 17.05,36.8 11.65,36.8 17.85,36.8
  pour Top (rank 2, no thermals): 8.65,41.2 28.75,41.2 28.75,35.6 8.65,35.6
  pour Bottom (rank 2, no thermals): 28.75,41.2 28.75,35.6 8.65,35.6 8.65,41.2
N$106
  Top 0.813: Q24.3 R137.2
N$107
  Top 0.5: Q24.1 23.4,37.35 R138.2
N$111  (via drill 0.3)
  other vias: 11.65,45.9 12.45,45.9 13.25,45.9 14.05,45.9 14.05,45.1 14.05,44.3 14.05,43.5 14.05,42.7 13.25,42.7 12.45,42.7 17.85,45.9 17.05,45.9 16.25,45.9 15.45,45.9 15.45,45.1 15.45,44.3 15.45,43.5 15.45,42.7 16.25,42.7 17.05,42.7 11.65,42.7 17.85,42.7
  pour Top (rank 2, no thermals): 8.65,47.1 28.75,47.1 28.75,41.51 8.65,41.51
  pour Bottom (rank 2, no thermals): 28.75,47.1 28.75,41.51 8.65,41.51 8.65,47.1
N$112
  Top 0.813: Q26.3 R145.2
N$113
  Top 0.5: Q26.1 23.4,43.25 R146.2
N$117  (via drill 0.3)
  other vias: 11.65,51.8 12.45,51.8 13.25,51.8 14.05,51.8 14.05,51 14.05,50.2 14.05,49.4 14.05,48.6 13.25,48.6 12.45,48.6 17.85,51.8 17.05,51.8 16.25,51.8 15.45,51.8 15.45,51 15.45,50.2 15.45,49.4 15.45,48.6 16.25,48.6 17.05,48.6 11.65,48.6 17.85,48.6
  pour Top (rank 2, no thermals): 8.65,53 28.75,53 28.75,47.41 8.65,47.41
  pour Bottom (rank 2, no thermals): 28.75,53 28.75,47.41 8.65,47.41 8.65,53
N$118
  Top 0.813: Q28.3 R153.2
N$119
  Top 0.5: Q28.1 23.4,49.15 R154.2
N$123  (via drill 0.3)
  other vias: 11.65,57.7 12.45,57.7 13.25,57.7 14.05,57.7 14.05,56.9 14.05,56.1 14.05,55.3 14.05,54.5 13.25,54.5 12.45,54.5 17.85,57.7 17.05,57.7 16.25,57.7 15.45,57.7 15.45,56.9 15.45,56.1 15.45,55.3 15.45,54.5 16.25,54.5 17.05,54.5 11.65,54.5 17.85,54.5
  pour Top (rank 2, no thermals): 8.65,58.9 28.75,58.9 28.75,53.3 8.65,53.3
  pour Bottom (rank 2, no thermals): 28.75,58.9 28.75,53.3 8.65,53.3 8.65,58.9
N$125
  Top 0.813: Q30.3 R161.2
N$126
  Top 0.5: Q30.1 23.4,55.05 R162.2
N$130  (via drill 0.3)
  other vias: 11.65,63.6 12.45,63.6 13.25,63.6 14.05,63.6 14.05,62.8 14.05,62 14.05,61.2 14.05,60.4 13.25,60.4 12.45,60.4 17.85,63.6 17.05,63.6 16.25,63.6 15.45,63.6 15.45,62.8 15.45,62 15.45,61.2 15.45,60.4 16.25,60.4 17.05,60.4 11.65,60.4 17.85,60.4
  pour Top (rank 2, no thermals): 8.65,64.8 28.75,64.8 28.75,59.2 8.65,59.2
  pour Bottom (rank 2, no thermals): 28.75,64.8 28.75,59.2 8.65,59.2 8.65,64.8
N$131
  Top 0.813: Q32.3 R169.2
N$132
  Top 0.5: Q32.1 23.4,60.95 R170.2
N$136  (via drill 0.3)
  other vias: 11.65,69.5 12.45,69.5 13.25,69.5 14.05,69.5 14.05,68.7 14.05,67.9 14.05,67.1 14.05,66.3 13.25,66.3 12.45,66.3 17.85,69.5 17.05,69.5 16.25,69.5 15.45,69.5 15.45,68.7 15.45,67.9 15.45,67.1 15.45,66.3 16.25,66.3 17.05,66.3 11.65,66.3 17.85,66.3
  pour Top (rank 2, no thermals): 8.65,70.7 28.75,70.7 28.75,65.11 8.65,65.11
  pour Bottom (rank 2, no thermals): 28.75,70.7 28.75,65.11 8.65,65.11 8.65,70.7
N$137
  Top 0.813: Q34.3 R177.2
N$138
  Top 0.5: Q34.1 23.4,66.85 R178.2
RSTDSPL  (via drill 0.35)
  Top 0.2: v3.3,85.8 3.75,86.25 U1.9
  Bottom 0.2: JP1.5 45.05,55.78 41.02,55.78 39.4,57.4 39.4,72.25 38.71,72.94 17.71,72.94 9.8,80.85 8.25,80.85 v3.3,85.8
S1  (via drill 0.35)
  Top 0.2: R97.1 25.47,0.9 25.55,0.98 v25.55,1.03 | v42.6,29.7 v42.59,29.71 IC2.25
  Bottom 0.2: v42.6,29.7 42.4,29.9 33.28,29.9 31.63,28.25 31.63,3.66 29,1.03 v25.55,1.03
S2  (via drill 0.35)
  Top 0.2: IC2.23 v32.91,30.21 v32.9,30.2 | v25.5,6.8 R102.1
  Bottom 0.2: v32.9,30.2 31.3,28.6 31.3,7.95 30.15,6.8 v25.5,6.8
S3  (via drill 0.35)
  Top 0.2: IC2.21 v32.91,31.21 v32.9,31.2 | v25.55,12.65 24.75,12.65 R106.1
  Bottom 0.2: v32.9,31.2 32.9,30.88 30.97,28.95 30.97,14.77 28.85,12.65 v25.55,12.65
S4  (via drill 0.35)
  Top 0.2: IC2.19 v32.9,32.2 | v25.55,18.6 R114.1
  Bottom 0.2: v32.9,32.2 30.65,29.95 30.65,20.5 28.75,18.6 v25.55,18.6
S5  (via drill 0.35)
  Top 0.2: IC2.17 v32.9,33.2 | v25.45,24.5 R122.1
  Bottom 0.2: v32.9,33.2 29.07,29.37 29.07,24.72 28.85,24.5 v25.45,24.5
S6  (via drill 0.35)
  Top 0.2: IC2.15 v32.91,34.21 v32.9,34.2 | v25.55,30.4 R130.1
  Bottom 0.2: v32.9,34.2 32.59,34.2 28.79,30.4 v25.55,30.4
S7  (via drill 0.35)
  Top 0.2: IC2.13 v32.9,35.2 | v25.6,36.3 R138.1
  Bottom 0.2: v32.9,35.2 29.85,35.2 28.75,36.3 v25.6,36.3
S8  (via drill 0.35)
  Top 0.2: IC2.11 v32.9,36.2 | v25.6,42.2 R146.1
  Bottom 0.2: v25.6,42.2 28.6,42.2 31.7,39.1 31.7,37.4 v32.9,36.2
S9  (via drill 0.35)
  Top 0.2: IC2.9 v32.9,37.2 | v25.4,48.1 R154.1
  Bottom 0.2: v32.9,37.2 32.05,38.05 32.05,39.21 28.95,42.31 28.95,47.75 28.6,48.1 v25.4,48.1
S10  (via drill 0.35)
  Top 0.2: IC2.7 v32.91,38.21 v32.9,38.2 | R162.1 v25.55,54
  Bottom 0.2: v32.9,38.2 32.4,38.7 32.4,39.33 29.28,42.45 29.28,47.88 28.98,48.18 28.98,53.72 28.7,54 v25.55,54
S11  (via drill 0.35)
  Top 0.2: IC2.5 34.18,39.23 v32.9,39.23 | v25.55,59.9 R170.1
  Bottom 0.2: v32.9,39.23 32.9,39.29 29.6,42.58 29.6,48.02 29.31,48.32 29.31,53.85 29,54.16 29,59.55 28.65,59.9 v25.55,59.9
S12  (via drill 0.35)
  Top 0.2: IC2.3 v32.91,40.21 v32.9,40.2 | v25.45,65.8 R178.1
  Bottom 0.2: v32.9,40.2 32.45,40.2 29.93,42.72 29.93,48.57 29.64,48.87 29.64,54.06 29.33,54.37 29.33,59.69 29,60.01 29,65.45 28.65,65.8 v25.45,65.8
SCLK  (via drill 0.35)
  Top 0.2: v41.25,59.4 41.6,59.05 41.6,45.27 39.5,43.17 39.5,39.05 40.34,38.21 IC2.42 | U1.15 8.05,83.63 9.5,82.18 v9.5,81.37
  Bottom 0.2: v9.5,81.37 9.5,81.52 10.49,81.52 18.42,73.6 39.52,73.6 40.1,73.01 40.1,60.55 v41.25,59.4 41.4,59.55 46.37,59.55 47.16,60.34 47.16,60.99 47.16,61.4 45.2,63.35 JP1.2
V+
  Top 0.254: IC2.1 34.2,43.02 R9.1 C20.2
VREF1
  Top 0.3: IC2.35 43.64,34.71 43.65,34.71 C1.1
VREF2  (via drill 0.35)
  Top 0.2: v30.15,24.35 30.25,24.35 37.95,32.05 38.4,32.05 v38.4,32.19 | R3.2 6.4,61.05 6.4,45.5 v6.3,45.5 | v7.3,16.2 7.3,15.45 R7.2 | C4.1 43,33.75 v42.7,33.45
  Top 0.3: IC2.34 42.29,34.21 42.65,33.85 43.55,33.85 C4.1
  Bottom 0.2: JP12.1 JP12.2 6.82,16.4 7.3,16.88 | 8.4,23.65 8.15,23.4 8.15,18.13 7.3,17.28 7.3,16.88 | v30.15,24.35 29.45,23.65 8.4,23.65 | 8.4,23.65 8.16,23.89 8.16,43.56 6.3,45.42 v6.3,45.5 | 7.3,16.88 v7.3,16.2 | v38.4,32.19 38.8,32.59 41.84,32.59 v42.7,33.45
VTEMP1  (via drill 0.35)
  Top 0.2: v29.25,6.3 30.68,7.72 30.68,23.24 38.15,30.71 IC2.27
  Top 0.3: IC2.27 42.24,30.71 42.25,30.7 R57.2
  Bottom 0.2: v29.25,6.3 28.9,5.95 8.7,5.95 4.42,10.23 4.42,13 JP13.1
VTEMP2  (via drill 0.35)
  Top 0.2: IC2.28 38.18,31.21 30.35,23.37 30.35,13.45 v29.5,12.6
  Top 0.3: R58.2 43.11,31.21 IC2.28
  Bottom 0.2: v29.5,12.6 28.75,11.85 8.1,11.85 5.41,14.54 4.35,14.54 3.21,13.4 JP13.2
VTEMPNORTH  (via drill 0.35)
  Top 0.2: IC2.32 v39.95,33.21 v39.95,33.2 | R3.1 v8.6,64.95 8.5,64.95 8.15,65.3 R4.2
  Bottom 0.2: v39.95,33.2 34.95,33.2 33.38,34.77 33.38,40.4 30.26,43.52 30.26,48.7 29.96,49 29.96,54.2 29.65,54.51 29.65,59.82 29.33,60.15 29.33,65.58 28.63,66.28 25.25,66.28 24.97,66 24.97,65.22 24.7,64.95 v8.6,64.95
VTEMPSOUTH  (via drill 0.35)
  Top 0.2: IC2.29 38.22,31.71 30.02,23.51 30.02,18.27 v29.85,18.1 | R7.1 8.25,12.8 v8.4,12.8 8.3,12.8 R8.2
  Bottom 0.2: v29.85,18.1 29.5,17.75 8.5,17.75 8.35,17.6 8.35,12.85 v8.4,12.8

## Text on the board
tNames: LED | SCK | SDA | DC | Reset | CS | EasyBMS / MEB / v3.0 / 22.02.2025 | GND | 5V | V+ | +5V | CANH | CANL | GND | 120R